# Altium schematic sheet Sheet1.SchDoc
size A4; SheetNumber: 1; SheetTotal: 1
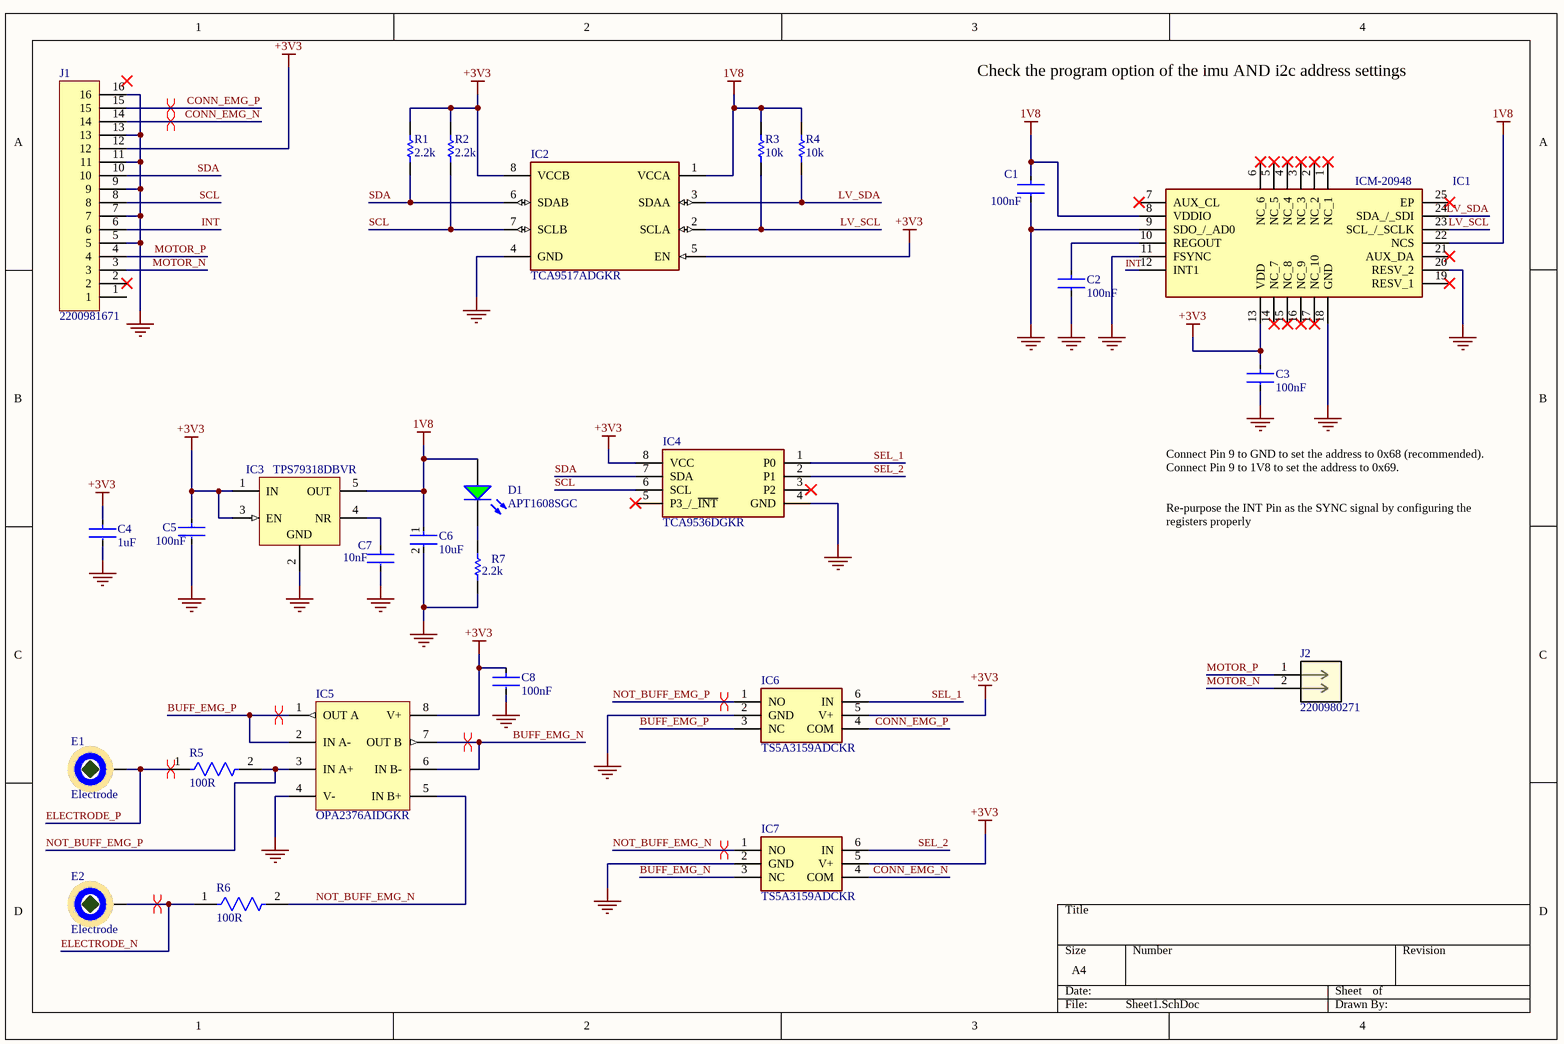
[diagram p0: Sheet1.SchDoc]

## Parts
C1  100nF  [FP-CC0603-DA-MFG]
C2  100nF  [FP-CC0603-DA-MFG]
C3  100nF  [FP-CC0603-DA-MFG]
C4  1uF  [FP-C0402C-BB-IPC_B]
C5  100nF  [FP-GRM155-0_05-MFG]
C6  10uF  [FP-GRM155-0_2-IPC_A]
C7  10nF  [FP-C0402-BB-MFG]
C8  100nF  [FP-CC0603-DA-MFG]
D1  APT1608SGC  [KING-APT1608SGC_V]
E1  Electrode  [Electrode]
E2  Electrode  [Electrode]
IC1  ICM-20948  [QFN40P300X300X105-25N-D]
IC2  TCA9517ADGKR  [FP-DGK0008A-IPC_C]
IC3  TPS79318DBVR  [DBV0005A_M]
IC4  TCA9536DGKR  [SOP65P490X110-8N]
IC5  OPA2376AIDGKR  [OPA2376]
IC6  TS5A3159ADCKR  [SOT65P210X110-6N]
IC7  TS5A3159ADCKR  [SOT65P210X110-6N]
J1  2200981671  [CONN_2200980000-SD_16_MOL]
J2  2200980271  [2X1_right_angle_THT_CON]
R1  2.2k  [RESC0402(1005)_N]
R2  2.2k  [RESC0402(1005)_N]
R3  10k  [RESC1005X40X20NL05T10]
R4  10k  [RESC1005X40X20NL05T10]
R5  100R  [FP-MCS0402-IPC_B]
R6  100R  [FP-MCS0402-IPC_B]
R7  2.2k  [RESC0402(1005)_N]

## Nets
1V8: C1.1 C6.1 D1.1(A) IC1.8(VDDIO) IC1.22(NCS) IC2.1(VCCA) IC3.5(OUT) R3.2 R4.2
+3V3: C3.1 C4.1 C5.1 C8.1 IC1.13(VDD) IC2.5(EN) IC2.8(VCCB) IC3.1(IN) IC3.3(EN) IC4.8(VCC) IC5.8(V+) IC6.5(V+) IC7.5(V+) J1.12 R1.2 R2.2
GND: C1.2 C2.2 C3.2 C4.2 C5.2 C6.2 C7.2 C8.2 IC1.9(SDO_/_AD0) IC1.11(FSYNC) IC1.18(GND) IC1.20(RESV_2) IC2.4(GND) IC3.2(GND) IC4.4(GND) IC5.4(V-) IC6.2(GND) IC7.2(GND) J1.5 J1.7 J1.9 J1.11 J1.13 J1.16 R7.1
BUFF_EMG_N: IC5.6(IN_B-) IC5.7(OUT_B) IC7.3(NC)
BUFF_EMG_P: IC5.1(OUT_A) IC5.2(IN_A-) IC6.3(NC)
CONN_EMG_N: IC7.4(COM) J1.14
CONN_EMG_P: IC6.4(COM) J1.15
ELECTRODE_N: E2.1 R6.1
ELECTRODE_P: E1.1 R5.1
INT: IC1.12(INT1) J1.6
LV_SCL: IC1.23(SCL_/_SCLK) IC2.2(SCLA) R3.1
LV_SDA: IC1.24(SDA_/_SDI) IC2.3(SDAA) R4.1
MOTOR_N: J1.3 J2.2
MOTOR_P: J1.4 J2.1
NOT_BUFF_EMG_N: IC5.5(IN_B+) IC7.1(NO) R6.2
NOT_BUFF_EMG_P: IC5.3(IN_A+) IC6.1(NO) R5.2
SCL: IC2.7(SCLB) IC4.6(SCL) J1.8 R2.1
SDA: IC2.6(SDAB) IC4.7(SDA) J1.10 R1.1
SEL_1: IC4.1(P0) IC6.6(IN)
SEL_2: IC4.2(P1) IC7.6(IN)
NetC2_1: C2.1 IC1.10(REGOUT)
NetC7_1: C7.1 IC3.4(NR)
NetD1_2: D1.2(K) R7.2

Not connected (* = marked no-connect by the designer): IC1 1(NC_1)* 2(NC_2)* 3(NC_3)* 4(NC_4)* 5(NC_5)* 6(NC_6)* 7(AUX_CL)* 14(NC_7)* 15(NC_8)* 16(NC_9)* 17(NC_10)* 19(RESV_1)* 21(AUX_DA)* 25(EP)*; IC4 3(P2)* 5(P3_/_~{INT})*; J1 1 2*

## Layout directives
differential pair; differential pair class DIFF90: BUFF_EMG_N, BUFF_EMG_P, CONN_EMG_N, CONN_EMG_P, ELECTRODE_N, ELECTRODE_P, NOT_BUFF_EMG_N, NOT_BUFF_EMG_P

## Notes on the sheet
- Check the program option of the imu AND i2c address settings
- Connect Pin 9 to GND to set the address to 0x68 (recommended).
  Connect Pin 9 to 1V8 to set the address to 0x69.
- Re-purpose the INT Pin as the SYNC signal by configuring the registers properly

## Library data of the parts
C1-C3 C8 = CMP-2100-03601-2: 100nF 50V X7R ±10% 0603 Multilayer Ceramic Capacitors MLCC - SMD/SMT ROHS; Manufacturer: YAGEO; Manufacturer Part Number: CC0603KRX7R9BB104; Temperature Coefficient: 15%; Tolerance: 0.1; Height: 0.9mm; Material: Ceramic; Voltage: 50 V; ComponentLink2Description: Datasheet; Device Class L2: Capacitors; Temperature Range High: +125°C; Category: Cap; Capacitance: 100 nF; Footprint Url: http://www.yageo.com/exep/pages/download/literatures/UPY-C_GEN_24.pdf; ComponentLink2URL: http://www.yageo.com/documents/recent/UPY-GPHC_X7R_6.3V-to-50V_18.pdf; Package: CC0603-DA; Temperature: -55°C to +125°C; Voltage Rating: 50 V; Temperature Characteristic: X7R; Device Class L1: Passive Components; Temperature Range Low: -55°C; RoHS: TRUE; Automotive: No; Value: 100 nF; Device Class L3: Ceramic Capacitors; Octopart: https://octopart.com/cc0603krx7r9bb104-yageo-42244635; Mouser Description: Multilayer Ceramic Capacitor, CC Series, 0.1 - F, - 10%, X7R, 50 V, 0603 [1608 Metric]; Lead Free: Yes; Digikey Description: CAP CER 0.1UF 50V X7R 0603
C4 = CMP-03020-034679-1: CAP CER 1UF 16V X5R 0402; MPN: C0402C105K4PACTU; Dielectric Material: Ceramic; Tolerance: 10%; RoHS Compliant: Yes; Voltage Rating (DC): 16V; Voltage Rating: 16V; Max Operating Temperature: 85°C; Packaging: Cut Tape; Width: 0.02inch; Dielectric: X5R; Lead Free: Lead Free; Min Operating Temperature: -55°C; Mount: Surface Mount; Case/Package: 0402; Thickness: 0.022inch; REACH SVHC: No SVHC; Length: 0.039inch; Case Code (Metric): 1005; Case Code (Imperial): 0402; Capacitance: 1uF
C5 = CMP-06035-019038-1: Chip Multilayer Ceramic Capacitors for General Purpose, 0402, 0.10uF, X7S, 22%, 10%, 50V; MPN: GRM155C71H104KE19D; Voltage Rating (DC): 50V; Dielectric: X7S; Width: 500um; Thickness: 500um; Length: 1mm; Tolerance: 10%; Capacitance: 100nF
C6 = CMP-06035-026070-1: Chip Multilayer Ceramic Capacitors for General Purpose, 0402, 10uF, X5R, 15%, 20%, 10V; MPN: GRM155R61A106ME11D
C7 = CMP-2008-02357-2: C0402 10,000 pF X7R 10.00% 50 V; Manufacturer: Kemet; Manufacturer Part Number: C0402C103K5RAC7411; Voltage Rating: 50 V; Tolerance: 0.1; Material: Ceramic; Temperature Coefficient: 15%; Octopart: https://octopart.com/c0402c103k5rac7411-kemet-25528449; Category: Cap; Temperature Range Low: -55°C; Device Class L2: Capacitors; Device Class L3: Ceramic Capacitors; Temperature: -55°C to +125°C; Lead Free: Yes; ComponentLink2Description: Datasheet; RoHS: TRUE; Value: 10,000 pF; Temperature Range High: +125°C; Ipc Land Pattern Name: CAPC10050X50; Height: 0.55mm; Package: C0402-BB; Capacitance: 10,000 pF; Device Class L1: Passive Components; ComponentLink2URL: https://content.kemet.com/datasheets/KEM_C1002_X7R_SMD.pdf; Automotive: No; Temperature Characteristic: X7R; Manufacture part Number: C0402C103K5RAC7411
D1 = CMP-2000-05789-1: Super Bright Green LED, 62.5 mW, 25 mA, -40 to 85 degC, 2-Pin SMD, RoHS, Tape and Reel; Manufacturer: Kingbright; Online Catalog: 0603RectanglewithFlatTopChipLEDs; Wavelength - Dominant: 568nm; Wavelength - Peak: 565nm; Voltage - Forward (Vf) (Typ): 2.2V; Lens Type: Clear; Other Names: 754-1121-2; Millicandela Rating: 15mcd; Catalog Drawings: APT1608SeriesTop / APT1608SeriesSide; Lens Style/Size: RectanglewithFlatTop,1.2mmx0.8mm; Current - Test: 20mA; 3D Model: APT1608x.sldprt / APT1608x.pro / APT1608x.igs / APT1608x.stp; Viewing Angle: 120°; Package / Case: 0603(1608Metric); Category: Optoelectronics; Package Description: 2-Pin Surface Mount Device, Body 0.8 x 1.6 mm; Mounting Type: SurfaceMount; Color: Green; Height: 0.75mm; Datasheet Version: Rev. 16B, 02/2012; Family: LEDIndication-Discrete; Manufacturer URL: http://www.kingbright.com/; Package Reference: APT1608SGC; Datasheet URL: https://datasheet.ciiva.com/2113/apt1608sgc-2113808.pdf; Mounting Technology: SurfaceMount; Packaging: Tape&Reel(TR); Standard Package: 2,000; Size / Dimension: 1.60mmLx0.80mmW
IC1 = ICM-20948: Integrated Circuit; Manufacturer_Name: TDK; Datasheet Link: https://www.digikey.ph/en/products/detail/tdk-invensense/ICM-20948/6623535?msockid=3bdc366bbe0663d83c1223c0bf3662a6; Height: 1.05mm; Manufacturer_Part_Number: ICM-20948; Mouser Part Number: 410-ICM-20948; Mouser Price/Stock: https://www.mouser.co.uk/ProductDetail/TDK-InvenSense/ICM-20948?qs=u4fy%2FsgLU9OtGc31yF%2Friw%3D%3D; Arrow Part Number: ICM-20948; Arrow Price/Stock: https://www.arrow.com/en/products/icm-20948/invensense.html?utm_currency=USD&region=nac
IC2 = CMP-04899-000095-1: IC TRNSLTR BIDIRECTIONAL 8VSSOP; Output Type: Voltage; Input Capacitance: 8pF; Number of Circuits: 1; Operating Supply Voltage: 5.5V; Propagation Delay: 110ns; Logic Function: Translator; Max Frequency: 400kHz; Number of Outputs: 2; Turn-On Delay Time: 141ns; Number of Pins: 8; Channel Type: Bidirectional; Packaging: Tape and Reel; Lead Free: Lead Free; Max Operating Temperature: 85°C; Mount: Surface Mount; Radiation Hardening: No; Case/Package: VSSOP; Min Operating Temperature: -40°C; Package Quantity: 2500; Number of Channels: 2; Number of Bits: 2; RoHS Compliant: Yes
IC3 = CMP-0394-00328-2: Single Output High PSRR LDO, 200 mA, Fixed 1.8 V Output, 2.7 to 5.5 V Input, 5-pin SOT-23 (DBV), -40 to 85 degC, Green (RoHS & no Sb/Br); Manufacturer: Texas Instruments; Vdo(Typ)(mV): 112; SubFamily: Single Channel LDO; Iq(Typ)(mA): 0.2; Vin(Max)(V): 5.5; Accuracy(%): 2; Rating: Catalog; Vin(Min)(V): 2.7; Vout Adj(Max)(V): 1.8; ComponentLink3URL: http://www.ti.com/litv/pdf/mpds018i; PackageVersion: 4073253-4/K; Eco-Plan: Green (RoHS & no Sb/Br); ComponentLink3Description: Package Specification; PackageDescription: 5-Pin Plastic Small Outline, Body 1.60 Ãƒâ€” 2.90 mm, Pitch 0.95 mm; Mounting Technology: Surface Mount; DatasheetVersion: SLVS348K; PartNumber: TPS79318DBVR; ComponentLink1Description: Manufacturer URL; ComponentLink2Description: Datasheet; PackageReference: DBV0005A; Iout(Max)(A): 0.2; Fixed Output Options(V): 1.8; Vout Adj(Min)(V): 1.8; Code_JEDEC: MO-178; ComponentLink1URL: http://www.ti.com/; ComponentLink2URL: http://www.ti.com/general/docs/lit/getliterature.tsp?genericPartNumber=TPS79318&fileType=pdf
IC4 = TCA9536DGKR: Integrated Circuit; Manufacturer_Name: Texas Instruments; Datasheet Link: https://www.ti.com/lit/ds/symlink/tca9536.pdf?ts=1641403369587&ref_url=https%253A%252F%252Fwww.ti.com%252Fproduct%252FTCA9536; Height: 1.1mm; Manufacturer_Part_Number: TCA9536DGKR; Mouser Part Number: 595-TCA9536DGKR; Mouser Price/Stock: https://www.mouser.co.uk/ProductDetail/Texas-Instruments/TCA9536DGKR?qs=doiCPypUmgHJyc0NMelqCA%3D%3D; Arrow Part Number: TCA9536DGKR; Arrow Price/Stock: https://www.arrow.com/en/products/tca9536dgkr/texas-instruments.html?utm_currency=USD&region=nac
IC5 = OPA2376AIDGKR: IC OPAMP GP 2 CIRCUIT 8VSSOP
IC6 IC7 = TS5A3159ADCKR: IC SWITCH SPDTX1 900MOHM SC70-6; Manufacturer_Name: Texas Instruments; Datasheet Link: http://www.ti.com/lit/gpn/ts5a3159a; Height: 1.1mm; Manufacturer_Part_Number: TS5A3159ADCKR; Mouser Part Number: 595-TS5A3159ADCKR; Mouser Price/Stock: https://www.mouser.co.uk/ProductDetail/Texas-Instruments/TS5A3159ADCKR?qs=0O%2FZFlpUpJWT7PTKGuP8wA%3D%3D; Arrow Part Number: TS5A3159ADCKR; Arrow Price/Stock: https://www.arrow.com/en/products/ts5a3159adckr/texas-instruments.html?utm_currency=USD&region=nac
J1 = 2200981671: Connector Header Through Hole, Right Angle 16 position 0.049" (1.25mm); MPN: 2200981671
J2 = 2X1_RHTANG_HDR: Molex connector
R1 R2 R7 = CMP-1011-00082-1: 2K2 0.063W 5% 0402 (1005 Metric)  SMD; MPN: CRCW04022K20JNTD; Value: 2200.00 Ohm; Case-EIA: 0402; Case-Metric: 1005; Tolerance: 5 %; Power: 0.063 W; Technology: SMT
R3 R4 = CMP-2002-01682-1: Manufacturer: Vishay BCcomponents; Part Number: TNPW040210K0DEED
R5 R6 = CMP-02407-000550-1: RES SMD 1.2K OHM 1% 1/10W 0402; MPN: MCS0402MD1000DE000; Voltage Rating: 50V; Temperature Coefficient: 25ppm/°C; Tolerance: 0.5%; Max Power Dissipation: 100mW; Composition: Thin Film; Length: 0.039inch; Lead Free: Lead Free; Case Code (Imperial): 0402; Package Quantity: 10000; Width: 0.02inch; Packaging: Tape and Reel; Contact Plating: Tin; Height: 0.015inch; Case/Package: 0402; Case Code (Metric): 1005; Weight: 2.3E-05oz; Max Operating Temperature: 175°C; Min Operating Temperature: -55°C; Features: Automotive AEC-Q200; Number of Terminations: 2; Power Rating: 100mW; Resistance: 100R; Termination: SMD/SMT